# Altium schematic sheet HVsense.SchDoc
size A3; CompanyName: Hydriven; Organization: Hydriven; Revision: V1.1; SheetNumber: 3; SheetTotal: 10; Team: 2025; Subsystem: Embedded Systems
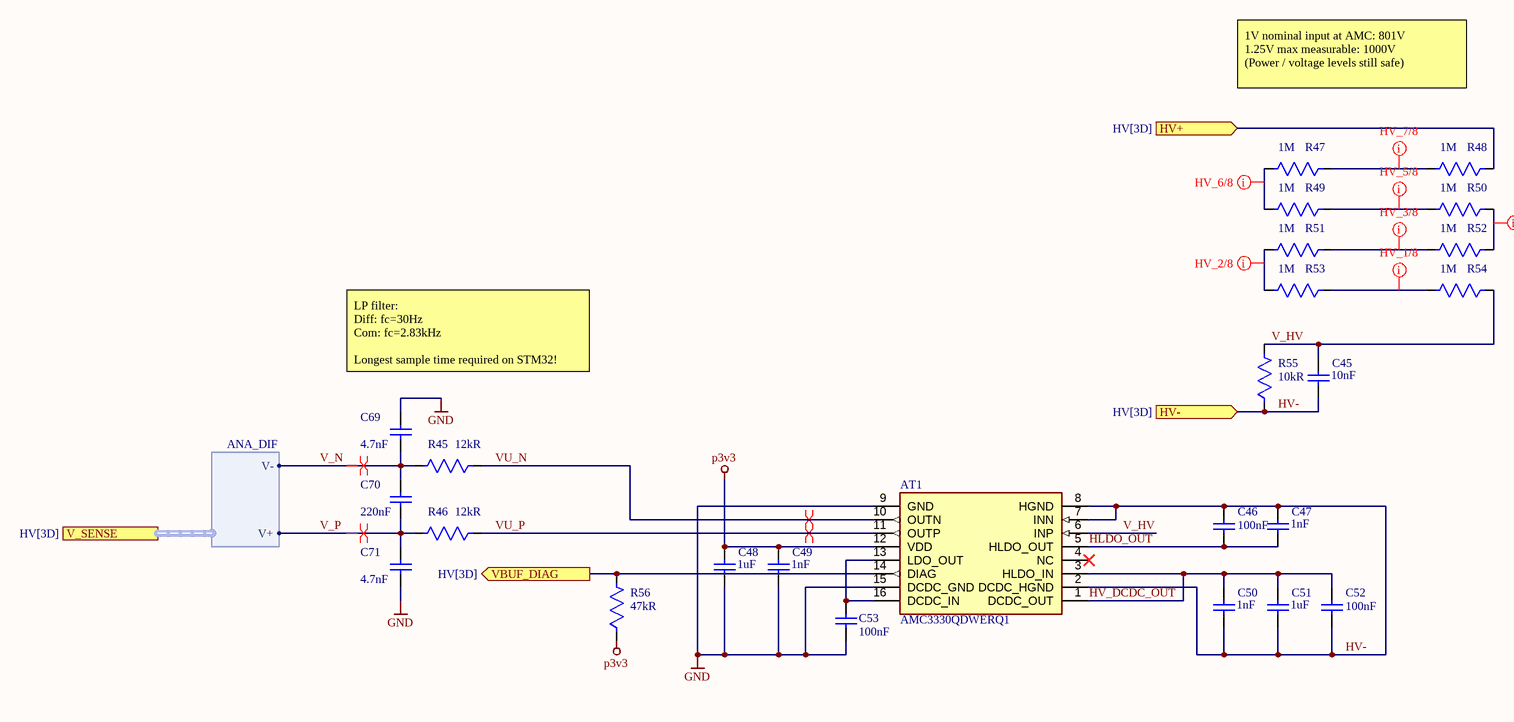
[diagram p0: HVsense.SchDoc]

## Parts
AT1  AMC3330QDWERQ1  [SOIC127P1030X265-16N]
C45  value 10nF  [WCAP-CSGP_0603_L1.6W0.8H0.8_Reflow]  (hidden comment: CAP 0603 10nF X7R)
C46  value 100nF  [WCAP-CSGP_0603_L1.6W0.8H0.8_Reflow]  (hidden comment: CAP 0603 100nF X7R)
C47  value 1nF  [WCAP-CSGP_0603_L1.6W0.8H0.8_Reflow]  (hidden comment: CAP 0603 1nF X7R)
C48  value 1uF  [WCAP-CSGP_0603_L1.6W0.8H0.8_Reflow]  (hidden comment: CAP 0603 1uF X7R)
C49  value 1nF  [WCAP-CSGP_0603_L1.6W0.8H0.8_Reflow]  (hidden comment: CAP 0603 1nF X7R)
C50  value 1nF  [WCAP-CSGP_0603_L1.6W0.8H0.8_Reflow]  (hidden comment: CAP 0603 1nF X7R)
C51  value 1uF  [WCAP-CSGP_0603_L1.6W0.8H0.8_Reflow]  (hidden comment: CAP 0603 1uF X7R)
C52  value 100nF  [WCAP-CSGP_0603_L1.6W0.8H0.8_Reflow]  (hidden comment: CAP 0603 100nF X7R)
C53  value 100nF  [WCAP-CSGP_0603_L1.6W0.8H0.8_Reflow]  (hidden comment: CAP 0603 100nF X7R)
C69  value 4.7nF  [WCAP-CSGP_0402_L1W0.5H0.5]  (hidden comment: CAP 0402 4.7nF X7R)
C70  value 220nF  [WCAP-CSGP_0402_L1W0.5H0.5]  (hidden comment: CAP 0402 220nF X7R)
C71  value 4.7nF  [WCAP-CSGP_0402_L1W0.5H0.5]  (hidden comment: CAP 0402 4.7nF X7R)
R45  value 12kR  [FP0402]  (hidden comment: RES 0402 12kR 1%)
R46  value 12kR  [FP0402]  (hidden comment: RES 0402 12kR 1%)
R47  value 1M  [RES_SM1206_YAGEORC_N]  (hidden comment: RES 1206 1M 1%)
R48  value 1M  [RES_SM1206_YAGEORC_N]  (hidden comment: RES 1206 1M 1%)
R49  value 1M  [RES_SM1206_YAGEORC_N]  (hidden comment: RES 1206 1M 1%)
R50  value 1M  [RES_SM1206_YAGEORC_N]  (hidden comment: RES 1206 1M 1%)
R51  value 1M  [RES_SM1206_YAGEORC_N]  (hidden comment: RES 1206 1M 1%)
R52  value 1M  [RES_SM1206_YAGEORC_N]  (hidden comment: RES 1206 1M 1%)
R53  value 1M  [RES_SM1206_YAGEORC_N]  (hidden comment: RES 1206 1M 1%)
R54  value 1M  [RES_SM1206_YAGEORC_N]  (hidden comment: RES 1206 1M 1%)
R55  value 10kR  [RES_SM0805_YAGEORC_N]  (hidden comment: RES 0805 10kR 1%)
R56  value 47kR  [RES_SM0603_YAGEORC_N]  (hidden comment: RES 0603 47kR 1%)

## Ports
HV+ (in, see HV[3D]), HV- (in, see HV[3D]), V_SENSE (harness ANA_DIF, see HV[3D]), VBUF_DIAG (out, see HV[3D])

## Harnesses
ANA_DIF: V+, V-

## Nets
GND: AT1.9(GND) AT1.15(DCDC_GND) C48.1 C49.1 C53.2 C69.2 C71.1
p3v3: AT1.12(VDD) C48.2 C49.2 R56.1
HLDO_OUT: AT1.5(HLDO_OUT) C46.2 C47.1
HV+: R48.1 ; port HV+
HV-: AT1.2(DCDC_HGND) AT1.7(INN) AT1.8(HGND) C45.1 C46.1 C47.2 C50.1 C51.1 C52.2 R55.1 ; port HV-
HV_DCDC_OUT: AT1.1(DCDC_OUT) AT1.3(HLDO_IN) C50.2 C51.2 C52.1
V_HV: AT1.6(INP) C45.2 R54.1 R55.2
V_N: C69.1 C70.2 R45.2 ; port V_SENSE.V-
V_P: C70.1 C71.2 R46.2 ; port V_SENSE.V+
VBUF_DIAG: AT1.14(DIAG) R56.2 ; port VBUF_DIAG
VU_N: AT1.10(OUTN) R45.1
VU_P: AT1.11(OUTP) R46.1
NetAT1_13: AT1.13(LDO_OUT) AT1.16(DCDC_IN) C53.1
NetR47_1: R47.1 R48.2
NetR47_2: R47.2 R49.2
NetR49_1: R49.1 R50.2
NetR50_1: R50.1 R52.1
NetR51_1: R51.1 R52.2
NetR51_2: R51.2 R53.2
NetR53_1: R53.1 R54.2

Not connected (* = marked no-connect by the designer): AT1 4(NC)*

## Layout directives
differential pair: V_N, V_P, VU_N, VU_P
net class HV_6/8: NetR47_2
net class HV_7/8: NetR47_1
net class HV_5/8: NetR49_1
net class HV_3/8: NetR51_1
net class HV_1/8: NetR53_1
net class HV_2/8: NetR51_2
net class HV_4/8: NetR50_1

## Notes on the sheet
- 1V nominal input at AMC: 801V
  1.25V max measurable: 1000V
  (Power / voltage levels still safe)
- LP filter:
  Diff: fc=30Hz
  Com: fc=2.83kHz
  Longest sample time required on STM32!
- Team
- Authors
- Revision
- Title
- Project
- Subsystem
- File
- Sheet
- //

## Library data of the parts
AT1 = AMC3330QDWERQ1: Attenuator or Isolator; Manufacturer_Name: Texas Instruments; Datasheet Link: https://www.ti.com/lit/ds/symlink/amc3330.pdf?ts=1605812770714&ref_url=https%253A%252F%252Fwww.ti.com%252Fsitesearch%252Fdocs%252Funiversalsearch.tsp%253FsearchTerm%253DAMC3330DWE; Height: 2.65mm; Manufacturer_Part_Number: AMC3330QDWERQ1; Mouser Part Number: 595-AMC3330QDWERQ1; Mouser Price/Stock: https://www.mouser.co.uk/ProductDetail/Texas-Instruments/AMC3330QDWERQ1?qs=81r%252BiQLm7BThq9fK1XpIYg%3D%3D; Arrow Part Number: AMC3330QDWERQ1; Arrow Price/Stock: https://www.arrow.com/en/products/amc3330qdwerq1/texas-instruments?utm_currency=USD&region=nac
C45-C53 = CMP-001-01309-1: GTT Standard 0603 non-polarized capacitor; Case/Package: 0603; Category: Multilayer Ceramic Chip Capacitors; Ceramic Type: X7R; Pins: 2
  C45: JLCPCB Part #: C57112
  C46 C52 C53: JLCPCB Part #: C14663
  C47 C49 C50: JLCPCB Part #: C1588
  C48 C51: JLCPCB Part #: C15849
C69-C71 = CMP-001-01308-5: GTT Standard 0402 non-polarized capacitor; Pins: 2; Case/Package: 0402; Category: Multilayer Ceramic Chip Capacitors; Ceramic Type: X7R
  C69 C71: JLCPCB Part #: C1538
  C70: JLCPCB Part #: C16772
R45 R46 = CMP-009-00204-17: GTT Standard 0402 Resistor; Voltage Rating: 50V; Power: 62.5mW; Mounting Technology: SMD; Tolerance: 1%; Case/Package: 0402; Design Item ID: RES 0402; Source: Passives.SchLib; JLCPCB Part #: C25752
R47-R54 = CMP-009-00208-3: GTT Standard 1206 Resistor; Voltage Rating: 50V; Power: 62.5mW; Tolerance: 1%; Case/Package: 1206; Mounting Technology: SMD; JLCPCB Part #: C17927
R55 = CMP-009-00205-3: GTT Standard 0805 Resistor; Power: 62.5mW; Voltage Rating: 50V; Mounting Technology: SMD; Case/Package: 0805; Tolerance: 1%; JLCPCB Part #: C17414
R56 = CMP-009-00206-3: GTT Standard 0603 Resistor; Voltage Rating: 50V; Power: 62.5mW; Case/Package: 0603; Tolerance: 1%; Mounting Technology: SMD; JLCPCB Part #: C25819